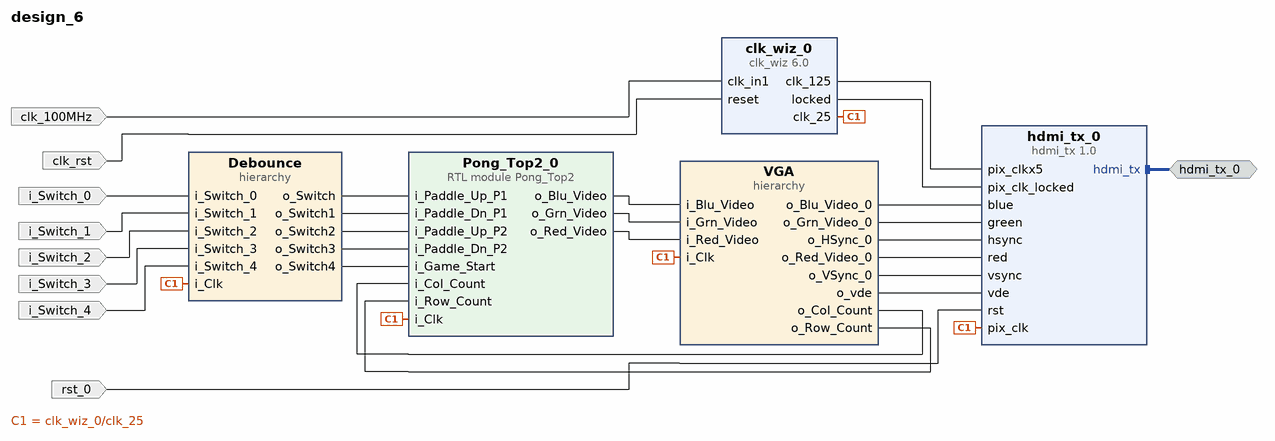
[diagram p0: block diagram of the top level]
# Vivado block design design_6, xc7s50csga324-1, Vivado 2024.2
create_bd_design design_6

create_bd_intf_port -mode Master -vlnv xilinx.com:interface:hdmi_rtl:2.0 hdmi_tx_0
create_bd_port -dir I i_Switch_0
create_bd_port -dir I i_Switch_1
create_bd_port -dir I i_Switch_2
create_bd_port -dir I i_Switch_3
create_bd_port -dir I i_Switch_4
create_bd_port -dir I -type clk clk_100MHz
set_property -dict {CONFIG.FREQ_HZ 100000000} [get_bd_ports clk_100MHz]
create_bd_port -dir I -type rst rst_0
create_bd_port -dir I -type rst clk_rst
set_property -dict {CONFIG.POLARITY ACTIVE_HIGH} [get_bd_ports clk_rst]

create_bd_cell -type module -reference Pong_Top2 Pong_Top2_0
create_bd_cell -type hier VGA
create_bd_cell -type hier Debounce
create_bd_cell -type ip -vlnv xilinx.com:ip:clk_wiz:6.0 clk_wiz_0
set_property -dict [list \
  CONFIG.CLKOUT1_JITTER 175.402 \
  CONFIG.CLKOUT1_PHASE_ERROR 98.575 \
  CONFIG.CLKOUT1_REQUESTED_OUT_FREQ 25.000 \
  CONFIG.CLKOUT2_JITTER 125.247 \
  CONFIG.CLKOUT2_PHASE_ERROR 98.575 \
  CONFIG.CLKOUT2_REQUESTED_OUT_FREQ 125.000 \
  CONFIG.CLKOUT2_USED true \
  CONFIG.CLK_OUT1_PORT clk_25 \
  CONFIG.CLK_OUT2_PORT clk_125 \
  CONFIG.MMCM_CLKFBOUT_MULT_F 10.000 \
  CONFIG.MMCM_CLKOUT0_DIVIDE_F 40.000 \
  CONFIG.MMCM_CLKOUT1_DIVIDE 8 \
  CONFIG.NUM_OUT_CLKS 2 \
  CONFIG.PRIM_SOURCE No_buffer \
] [get_bd_cells clk_wiz_0]
create_bd_cell -type ip -vlnv realdigital.org:realdigital:hdmi_tx:1.0 hdmi_tx_0
set_property -dict {CONFIG.C_BLUE_WIDTH 3 CONFIG.C_GREEN_WIDTH 3 CONFIG.C_RED_WIDTH 3 CONFIG.MODE DVI} [get_bd_cells hdmi_tx_0]

# ---- hierarchy /VGA ----
current_bd_instance /VGA
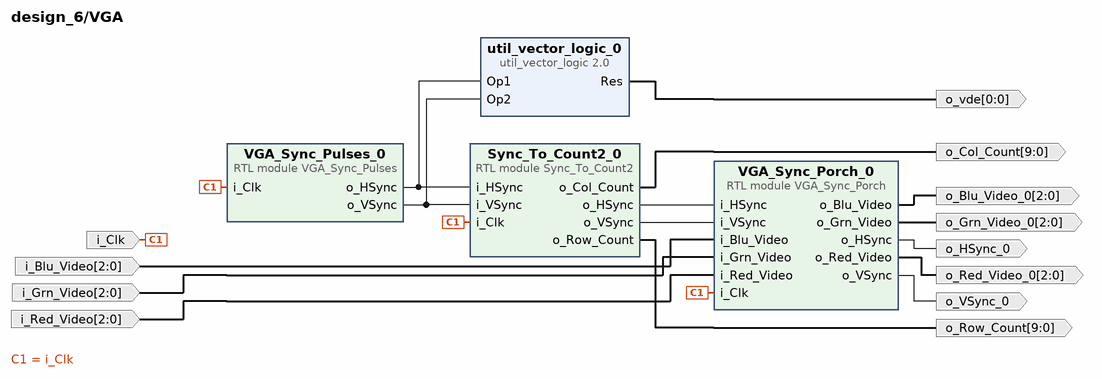
[diagram p1: block diagram inside /VGA]
create_bd_pin -dir O -from 9 -to 0 o_Col_Count
create_bd_pin -dir O -from 9 -to 0 o_Row_Count
create_bd_pin -dir I -from 2 -to 0 i_Red_Video
create_bd_pin -dir I -from 2 -to 0 i_Blu_Video
create_bd_pin -dir I -from 2 -to 0 i_Grn_Video
create_bd_pin -dir O o_VSync_0
create_bd_pin -dir O o_HSync_0
create_bd_pin -dir O -from 2 -to 0 o_Grn_Video_0
create_bd_pin -dir O -from 2 -to 0 o_Red_Video_0
create_bd_pin -dir O -from 2 -to 0 o_Blu_Video_0
create_bd_pin -dir I -type clk i_Clk
create_bd_pin -dir O -from 0 -to 0 o_vde

create_bd_cell -type module -reference Sync_To_Count2 Sync_To_Count2_0
create_bd_cell -type module -reference VGA_Sync_Porch VGA_Sync_Porch_0
create_bd_cell -type module -reference VGA_Sync_Pulses VGA_Sync_Pulses_0
create_bd_cell -type ip -vlnv xilinx.com:ip:util_vector_logic:2.0 util_vector_logic_0
set_property -dict {CONFIG.C_OPERATION and CONFIG.C_SIZE 1} [get_bd_cells util_vector_logic_0]

# ---- hierarchy /Debounce ----
current_bd_instance /Debounce
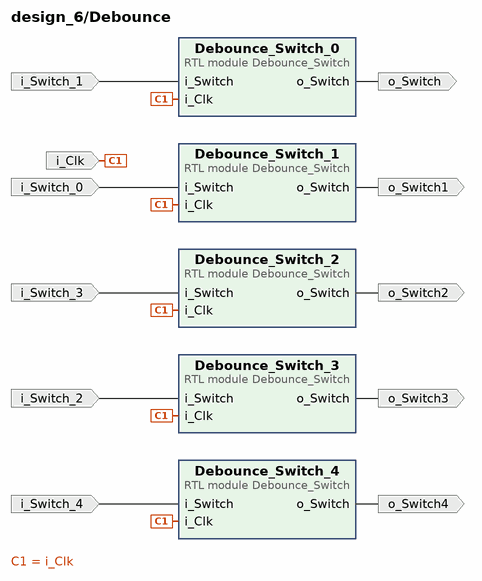
[diagram p2: block diagram inside /Debounce]
create_bd_pin -dir O o_Switch
create_bd_pin -dir O o_Switch1
create_bd_pin -dir O o_Switch2
create_bd_pin -dir O o_Switch3
create_bd_pin -dir O o_Switch4
create_bd_pin -dir I i_Switch_0
create_bd_pin -dir I i_Switch_1
create_bd_pin -dir I i_Switch_2
create_bd_pin -dir I i_Switch_3
create_bd_pin -dir I i_Switch_4
create_bd_pin -dir I -type clk i_Clk

create_bd_cell -type module -reference Debounce_Switch Debounce_Switch_3
create_bd_cell -type module -reference Debounce_Switch Debounce_Switch_4
create_bd_cell -type module -reference Debounce_Switch Debounce_Switch_0
create_bd_cell -type module -reference Debounce_Switch Debounce_Switch_2
create_bd_cell -type module -reference Debounce_Switch Debounce_Switch_1

# ---- connections ----

current_bd_instance /VGA
connect_bd_net [get_bd_pins i_Clk] [get_bd_pins VGA_Sync_Porch_0/i_Clk] [get_bd_pins VGA_Sync_Pulses_0/i_Clk] [get_bd_pins Sync_To_Count2_0/i_Clk]
connect_bd_net [get_bd_pins Sync_To_Count2_0/o_Col_Count] [get_bd_pins o_Col_Count]
connect_bd_net [get_bd_pins Sync_To_Count2_0/o_HSync] [get_bd_pins VGA_Sync_Porch_0/i_HSync]
connect_bd_net [get_bd_pins Sync_To_Count2_0/o_Row_Count] [get_bd_pins o_Row_Count]
connect_bd_net [get_bd_pins Sync_To_Count2_0/o_VSync] [get_bd_pins VGA_Sync_Porch_0/i_VSync]
connect_bd_net [get_bd_pins VGA_Sync_Porch_0/o_Blu_Video] [get_bd_pins o_Blu_Video_0]
connect_bd_net [get_bd_pins VGA_Sync_Porch_0/o_Grn_Video] [get_bd_pins o_Grn_Video_0]
connect_bd_net [get_bd_pins VGA_Sync_Porch_0/o_HSync] [get_bd_pins o_HSync_0]
connect_bd_net [get_bd_pins VGA_Sync_Porch_0/o_Red_Video] [get_bd_pins o_Red_Video_0]
connect_bd_net [get_bd_pins VGA_Sync_Porch_0/o_VSync] [get_bd_pins o_VSync_0]
connect_bd_net [get_bd_pins VGA_Sync_Pulses_0/o_HSync] [get_bd_pins Sync_To_Count2_0/i_HSync] [get_bd_pins util_vector_logic_0/Op1]
connect_bd_net [get_bd_pins VGA_Sync_Pulses_0/o_VSync] [get_bd_pins Sync_To_Count2_0/i_VSync] [get_bd_pins util_vector_logic_0/Op2]
connect_bd_net [get_bd_pins i_Blu_Video] [get_bd_pins VGA_Sync_Porch_0/i_Blu_Video]
connect_bd_net [get_bd_pins i_Grn_Video] [get_bd_pins VGA_Sync_Porch_0/i_Grn_Video]
connect_bd_net [get_bd_pins i_Red_Video] [get_bd_pins VGA_Sync_Porch_0/i_Red_Video]
connect_bd_net [get_bd_pins util_vector_logic_0/Res] [get_bd_pins o_vde]

current_bd_instance /Debounce
connect_bd_net [get_bd_pins Debounce_Switch_0/o_Switch] [get_bd_pins o_Switch]
connect_bd_net [get_bd_pins Debounce_Switch_1/o_Switch] [get_bd_pins o_Switch1]
connect_bd_net [get_bd_pins Debounce_Switch_2/o_Switch] [get_bd_pins o_Switch2]
connect_bd_net [get_bd_pins Debounce_Switch_3/o_Switch] [get_bd_pins o_Switch3]
connect_bd_net [get_bd_pins Debounce_Switch_4/o_Switch] [get_bd_pins o_Switch4]
connect_bd_net [get_bd_pins i_Clk] \
  [get_bd_pins Debounce_Switch_0/i_Clk] [get_bd_pins Debounce_Switch_1/i_Clk] [get_bd_pins Debounce_Switch_2/i_Clk] \
  [get_bd_pins Debounce_Switch_3/i_Clk] [get_bd_pins Debounce_Switch_4/i_Clk]
connect_bd_net -net i_Switch_0_1 [get_bd_pins i_Switch_0] [get_bd_pins Debounce_Switch_1/i_Switch]
connect_bd_net -net i_Switch_1_1 [get_bd_pins i_Switch_1] [get_bd_pins Debounce_Switch_0/i_Switch]
connect_bd_net -net i_Switch_2_1 [get_bd_pins i_Switch_2] [get_bd_pins Debounce_Switch_3/i_Switch]
connect_bd_net -net i_Switch_3_1 [get_bd_pins i_Switch_3] [get_bd_pins Debounce_Switch_2/i_Switch]
connect_bd_net -net i_Switch_4_1 [get_bd_pins i_Switch_4] [get_bd_pins Debounce_Switch_4/i_Switch]

current_bd_instance /
connect_bd_intf_net [get_bd_intf_ports hdmi_tx_0] [get_bd_intf_pins hdmi_tx_0/hdmi_tx]
connect_bd_net [get_bd_pins Debounce/o_Switch] [get_bd_pins Pong_Top2_0/i_Paddle_Up_P1]
connect_bd_net [get_bd_pins Debounce/o_Switch1] [get_bd_pins Pong_Top2_0/i_Paddle_Dn_P1]
connect_bd_net [get_bd_pins Debounce/o_Switch2] [get_bd_pins Pong_Top2_0/i_Paddle_Up_P2]
connect_bd_net [get_bd_pins Debounce/o_Switch3] [get_bd_pins Pong_Top2_0/i_Paddle_Dn_P2]
connect_bd_net [get_bd_pins Debounce/o_Switch4] [get_bd_pins Pong_Top2_0/i_Game_Start]
connect_bd_net [get_bd_pins Pong_Top2_0/o_Blu_Video] [get_bd_pins VGA/i_Blu_Video]
connect_bd_net [get_bd_pins Pong_Top2_0/o_Grn_Video] [get_bd_pins VGA/i_Grn_Video]
connect_bd_net [get_bd_pins Pong_Top2_0/o_Red_Video] [get_bd_pins VGA/i_Red_Video]
connect_bd_net [get_bd_pins VGA/o_Blu_Video_0] [get_bd_pins hdmi_tx_0/blue]
connect_bd_net [get_bd_pins VGA/o_Col_Count] [get_bd_pins Pong_Top2_0/i_Col_Count]
connect_bd_net [get_bd_pins VGA/o_Grn_Video_0] [get_bd_pins hdmi_tx_0/green]
connect_bd_net [get_bd_pins VGA/o_HSync_0] [get_bd_pins hdmi_tx_0/hsync]
connect_bd_net [get_bd_pins VGA/o_Red_Video_0] [get_bd_pins hdmi_tx_0/red]
connect_bd_net [get_bd_pins VGA/o_Row_Count] [get_bd_pins Pong_Top2_0/i_Row_Count]
connect_bd_net [get_bd_pins VGA/o_VSync_0] [get_bd_pins hdmi_tx_0/vsync]
connect_bd_net [get_bd_pins VGA/o_vde] [get_bd_pins hdmi_tx_0/vde]
connect_bd_net [get_bd_ports clk_100MHz] [get_bd_pins clk_wiz_0/clk_in1]
connect_bd_net [get_bd_pins clk_wiz_0/clk_25] \
  [get_bd_pins Debounce/i_Clk] [get_bd_pins Pong_Top2_0/i_Clk] [get_bd_pins VGA/i_Clk] [get_bd_pins hdmi_tx_0/pix_clk]
connect_bd_net [get_bd_pins clk_wiz_0/clk_125] [get_bd_pins hdmi_tx_0/pix_clkx5]
connect_bd_net [get_bd_pins clk_wiz_0/locked] [get_bd_pins hdmi_tx_0/pix_clk_locked]
connect_bd_net -net i_Switch_0_1 [get_bd_ports i_Switch_0] [get_bd_pins Debounce/i_Switch_0]
connect_bd_net -net i_Switch_1_1 [get_bd_ports i_Switch_1] [get_bd_pins Debounce/i_Switch_1]
connect_bd_net -net i_Switch_2_1 [get_bd_ports i_Switch_2] [get_bd_pins Debounce/i_Switch_2]
connect_bd_net -net i_Switch_3_1 [get_bd_ports i_Switch_3] [get_bd_pins Debounce/i_Switch_3]
connect_bd_net -net i_Switch_4_1 [get_bd_ports i_Switch_4] [get_bd_pins Debounce/i_Switch_4]
connect_bd_net -net reset_0_1 [get_bd_ports clk_rst] [get_bd_pins clk_wiz_0/reset]
connect_bd_net -net rst_0_1 [get_bd_ports rst_0] [get_bd_pins hdmi_tx_0/rst]

validate_bd_design
save_bd_design
